# EAGLE schematic 1 (EAGLE 6.2)
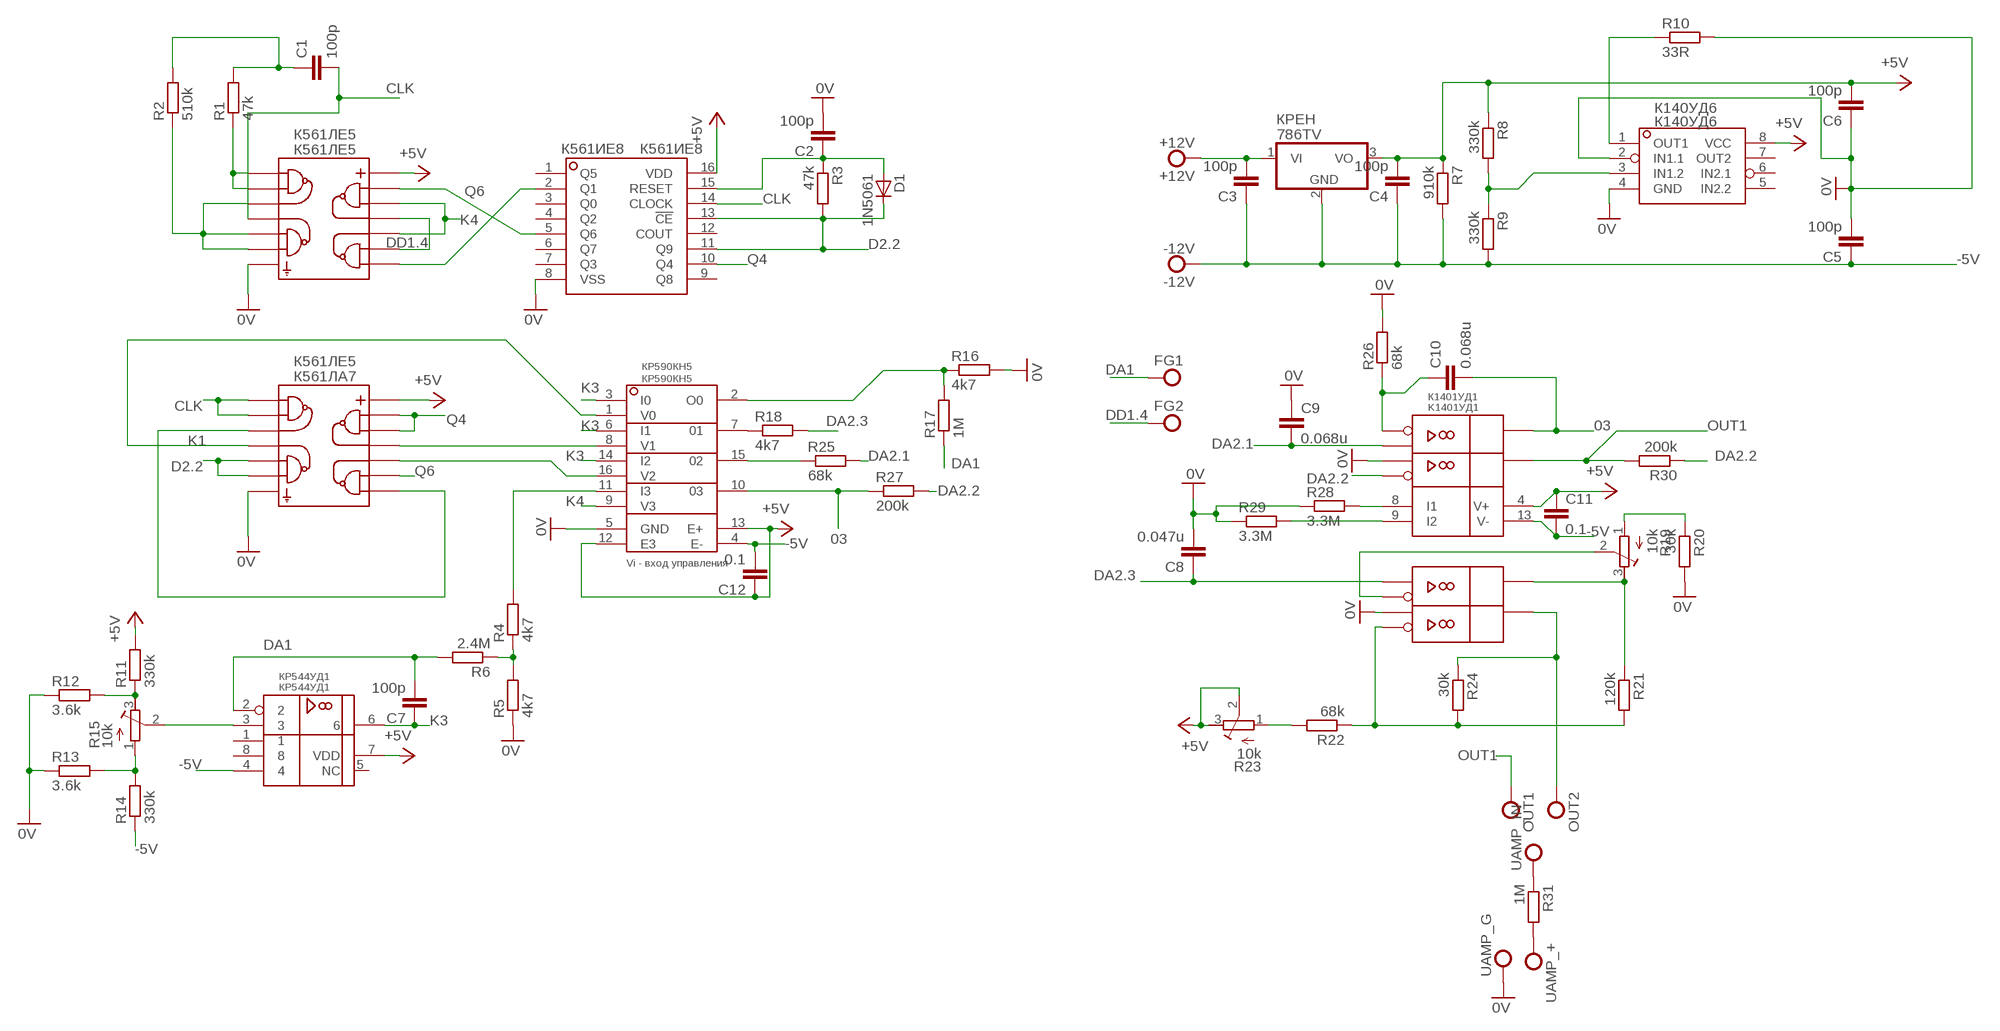
[diagram p0: schematic, sheet 1]

## Parts
+12V  +12V  PIN1  [PIN1]
-12V  -12V  PIN1  [PIN1]
C1  100p  C-EU025-025X050  [C025-025X050]
C2  100p  C-EU025-025X050  [C025-025X050]
C3  100p  C-EU025-025X050  [C025-025X050]
C4  100p  C-EU025-025X050  [C025-025X050]
C5  100p  C-EU025-025X050  [C025-025X050]
C6  100p  C-EU025-025X050  [C025-025X050]
C7  100p  C-EU025-025X050  [C025-025X050]
C8  0.047u  C-EU025-025X050  [C025-025X050]
C9  0.068u  C-EU025-025X050  [C025-025X050]
C10  0.068u  C-EU025-025X050  [C025-025X050]
C11  0.1  C-EU025-025X050  [C025-025X050]
C12  0.1  C-EU025-025X050  [C025-025X050]
D1  1N5061  [DO41-10]
FG1  PIN1  [PIN1]
FG2  PIN1  [PIN1]
OUT1  PIN1  [PIN1]
OUT2  PIN1  [PIN1]
R1  47k  MLT025"  [0207/10]
R2  510k  MLT025"  [0207/10]
R3  47k  MLT025"  [0207/10]
R4  4k7  MLT025"  [0207/10]
R5  4k7  MLT025"  [0207/10]
R6  2.4M  MLT025"  [0207/10]
R7  910k  MLT025"  [0207/10]
R8  330k  MLT025"  [0207/10]
R9  330k  MLT025"  [0207/10]
R10  33R  MLT025"  [0207/10]
R11  330k  MLT025"  [0207/10]
R12  3.6k  MLT025"  [0207/10]
R13  3.6k  MLT025"  [0207/10]
R14  330k  MLT025"  [0207/10]
R15  10k  R-TRIMM64W  [RTRIM64W]
R16  4k7  MLT025"  [0207/10]
R17  1M  MLT025"  [0207/10]
R18  4k7  MLT025"  [0207/10]
R19  10k  R-TRIMM64W  [RTRIM64W]
R20  30k  MLT025"  [0207/10]
R21  120k  MLT025"  [0207/10]
R22  68k  MLT025"  [0207/10]
R23  10k  R-TRIMM64W  [RTRIM64W]
R24  30k  MLT025"  [0207/10]
R25  68k  MLT025"  [0207/10]
R26  68k  MLT025"  [0207/10]
R27  200k  MLT025"  [0207/10]
R28  3.3M  MLT025"  [0207/10]
R29  3.3M  MLT025"  [0207/10]
R30  200k  MLT025"  [0207/10]
R31  1M  MLT025"  [0207/10]
U1  К561ИЕ8  [DIL16]
U2  К561ЛЕ5  K561ЛЕ5  [DIL14]
U3  КР544УД1  КР544УД1А  [DIL08]
U4  КР590КН5  [DIL16]
U5  K1401УД1  К1401УД3  [DIL16]
U6  К140УД6  [DIL08]
U7  К561ЛА7  [DIL14]
UAMP_+  PIN1  [PIN1]
UAMP_G  PIN1  [PIN1]
UAMP_IN  PIN1  [PIN1]
КРЕН  786TV  [TO220V]

## Nets
0V: C2.2 C5.2 C6.1 C8.2 C9.1 R5.1 R10.2 R12.1 R13.1 R16.2 R20.2 R26.2 R28.1 R29.1 U1.8(VSS) U2.7 U4.5(GND) U5.5 U5.14 U6.2(IN1.1) U6.4(GND) U7.7 UAMP_G.P$1
03: C10.2 R27.1 U4.10 U5.1
+5V: C4.2 C6.2 C11.1 C12.1 R7.1 R8.1 R11.2 R23.2(S) R23.3(A) U1.16(VDD) U2.14 U3.7(VDD) U4.12(E3) U4.13(E+) U5.4(V+) U6.8(VCC) U7.14 КРЕН.3(VO)
-5V: -12V.P$1 C3.1 C4.1 C5.1 C11.2 C12.2 R7.2 R9.2 R14.1 U3.4 U4.4(E-) U5.13(V-) КРЕН.2(GND)
CLK: C1.2 U1.14(CLOCK) U2.4 U7.1 U7.2
D2.1: U7.3 U7.8
D2.2: D1.C R3.2 U1.11(Q9) U1.13(!CE) U7.5 U7.6
DA1: C7.2 FG1.P$1 R6.2 R17.1 U3.2
DA2.1: C9.2 R25.2 U5.3
DA2.2: R27.2 R30.1 U5.6
DA2.3: C8.1 R18.2 U5.12
DD1.4: FG2.P$1 U2.9 U2.11
K1: U4.1(V0) U7.4
K2: U7.11
K3: C7.1 U3.6 U4.3(I0) U4.6(I1) U4.14(I2)
K4: U2.10 U2.12 U4.9(V3)
N$1: R1.1 U2.1 U2.2
N$2: C1.1 R1.2 R2.2
N$3: R2.1 U2.3 U2.5 U2.6
N$4: R18.1 U4.7
N$5: U4.16(V2) U7.10
N$6: U1.2(Q1) U2.8
N$7: C2.1 D1.A R3.1 U1.15(RESET)
N$8: +12V.P$1 C3.2 КРЕН.1(VI)
N$9: R4.2 U4.11(I3)
N$10: R4.1 R5.2 R6.1
N$11: R11.1 R12.2 R15.3(A)
N$12: R8.2 R9.1 U6.3(IN1.2)
N$13: R13.2 R14.2 R15.1(E)
N$14: R15.2(S) U3.3
N$15: R10.1 U6.1(OUT1)
N$16: R16.1 R17.2 U4.2(O0)
N$17: R25.1 U4.15
N$18: R19.2(S) U5.11
N$19: R19.3(A) R21.1 U5.10
N$20: R19.1(E) R20.1
N$21: R21.2 R22.1 R24.2 U5.15
N$22: R22.2 R23.1(E)
N$23: OUT2.P$1 R24.1 U5.16
N$24: C10.1 R26.1 U5.2
N$25: R28.2 U5.8(I1)
N$26: R29.2 U5.9(I2)
N$27: R31.1 UAMP_IN.P$1
N$28: R31.2 UAMP_+.P$1
OUT1: OUT1.P$1 R30.2 U5.7
Q4: U1.10(Q4) U7.12 U7.13
Q6: U1.5(Q6) U2.13 U7.9
Unconnected: U1.1(Q5) U1.3(Q0) U1.4(Q2) U1.6(Q7) U1.7(Q3) U1.9(Q8) U1.12(COUT) U3.1 U3.5(NC) U3.8 U4.8(V1) U6.5(IN2.2) U6.6(IN2.1) U6.7(OUT2)

## Library data of the parts
+12V -12V FG1 FG2 OUT1 OUT2 UAMP_+ UAMP_G UAMP_IN = den:PIN1
C1-C12 = rcl:C-EU: CAPACITOR, European symbol
D1 = den:1N5061
R1-R14 R16-R18 R20-R22 R24-R31 = den:MLT025
R15 R19 R23 = resistor:R-TRIMM: Trimm resistor
U1 = yri:К561ИЕ8
U2 = yri:K561ЛЕ5
U3 = yri:КР544УД1А
U4 = yri:КР590КН5
U5 = yri:К1401УД3
U6 = yri:К140УД6
U7 = yri:К561ЛА7
КРЕН = linear:78*: Positive VOLTAGE REGULATOR Source: http://cache.national.com/ds/LM/LM78L05.pdf http://www.fairchildsemi.com/ds/LM/LM7805.pdf